# Altium schematic sheet main.SchDoc
size A; SheetNumber: 1; SheetTotal: 1
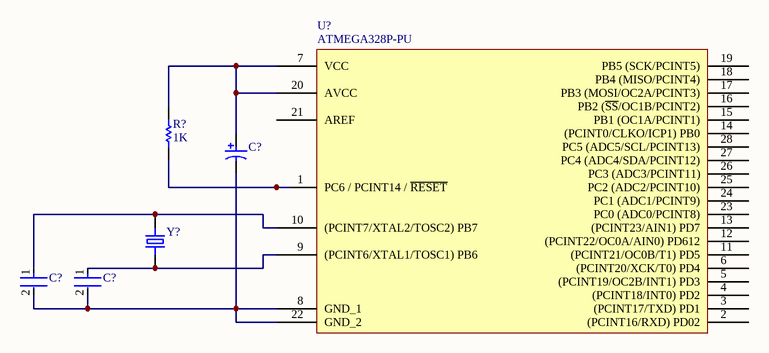
[diagram p0: main.SchDoc]

## Parts
(Parts that share a designator on the sheet are numbered #1, #2 ... from top to bottom, then left to right.)
C?#1  EEE-1CA100SR  [PNSC-EEE1CA100SR_L]  (value not drawn)
C?#2  02013A220JAT2A  [FP-0201-L_0_6_0_09-W_0_3-MFG]  (value not drawn)
C?#3  02013A220JAT2A  [FP-0201-L_0_6_0_09-W_0_3-MFG]  (value not drawn)
R?  1K  [RESA60-630X240]
U?  ATMEGA328P-PU  [27_DIP_7.62mm]
Y?  ECS-160-S-1X  [XTAL_ECS-160-S-1X]  (value not drawn)

## Nets
NetC?#1_1: C?#1.1 R?.1 U?.7(VCC) U?.20(AVCC)
NetC?#1_2: C?#1.2 C?#2.2 C?#3.2 U?.8(GND_1) U?.22(GND_2)
NetC?#2_1: C?#2.1 U?.10((PCINT7/XTAL2/TOSC2)_PB7) Y?.2
NetC?#3_1: C?#3.1 U?.9((PCINT6/XTAL1/TOSC1)_PB6) Y?.1
NetR?_2: R?.2 U?.1(PC6_/_PCINT14_/_~{RESET})

Not connected (* = marked no-connect by the designer): U? 2((PCINT16/RXD)_PD02) 3((PCINT17/TXD)_PD1) 4((PCINT18/INT0)_PD2) 5((PCINT19/OC2B/INT1)_PD3) 6((PCINT20/XCK/T0)_PD4) 11((PCINT21/OC0B/T1)_PD5) 12((PCINT22/OC0A/AIN0)_PD612) 13((PCINT23/AIN1)_PD7) 14((PCINT0/CLKO/ICP1)_PB0) 15(PB1_(OC1A/PCINT1)) 16(PB2_(~{SS}/OC1B/PCINT2)) 17(PB3_(MOSI/OC2A/PCINT3)) 18(PB4_(MISO/PCINT4)) 19(PB5_(SCK/PCINT5)) 21(AREF) 23(PC0_(ADC0/PCINT8)) 24(PC1_(ADC1/PCINT9)) 25(PC2_(ADC2/PCINT10)) 26(PC3_(ADC3/PCINT11)) 27(PC4_(ADC4/SDA/PCINT12)) 28(PC5_(ADC5/SCL/PCINT13))

## Library data of the parts
C?#1 = CMP-2000-06199-1: Aluminum Electrolytic Capacitor, 10 uF, +/- 20%, -40 to 85 degC, 2-Pin SMD, RoHS, Tape and Reel; Manufacturer: Panasonic; Lead Length: 1.8mm; No. of Pins: 2; Ripple Current Frequency: 120Hz; Ripple Current Temperature: 85°C; External Depth: 4.3mm; Operating Lifetime: 2000h; Power Factor: 0.16; Lead Cross-section Width: 0.65mm; Product Range: PANASONIC-SSeries; Voltage Rating V DC: 16V; Leakage Current: 3µA; Ripple Current AC: 28mA; AE Capacitor Case: RadialCan-SMD; Capacitance: 10µF; Lifetime @ Temperature: 2000hours@85°C; External Length / Height: 5.4mm; SVHC: NoSVHC(16-Dec-2013); Packaging: CutTape; Series: VS; Package Description: 2-Pin Surface Mount Device, Body 4.5 x 4.5 mm; Tolerance -: 20%; Capacitor Terminals: SMD; Lead Spacing: 1mm; Package / Case: B; Capacitance Tolerance: ±20%; Operating life Time: 2000h; Tape Width: 12mm; Power Factor Frequency: 120Hz; Voltage Rating: 16V; Diameter: 4mm; Operating Temperature Max: 85°C; Datasheet URL: https://datasheet.ciiva.com/19458/1355487-19458346.pdf; Capacitor Mounting: SMD; External Width: 4.3mm; Operating Life Temperature: 85°C; Capacitance Tolerance ±: ±20%; Package Reference: EEE1CA100SR; AC Ripple Current: 28mA; Tolerance +: 20%; Height: 5.4mm; Datasheet Version: 04/2005; Operating Temperature Min: -40°C; Capacitor Case Style: RadialCan-SMD; Mounting Technology: SurfaceMount; Operating Temperature Range: -40°Cto+85°C; Manufacturer URL: http://www.panasonic.com/; Life Time @ Temperature: 2000hours@85°C
C?#2 C?#3 = CMP-2010-00022-2: General Purpose Ceramic Capacitor, 0201, 22pF, 5%, C0G, 30ppm/°C, 25V; Depth: 0.3mm; Termination: SMD/SMT; Voltage: 25V; Packaging: Tape and Reel; Radiation Hardening: No; Package Quantity: 1; Case/Package: 0201; Case Code (Metric): 0603; Thickness: 0.013inch; Tolerance: 5%; Voltage Rating (DC): 25V; Voltage Rating: 25V; Number of Pins: 2; Dielectric: C0G; Height: 0.33mm; Capacitance: 22pF; Min Operating Temperature: -55°C; RoHS Compliant: Yes; Lead Free: Lead Free; Length: 0.6mm; Series: -; REACH SVHC: No SVHC; Width: 0.3mm; Construction: Flat; Case Code (Imperial): 0201; Mount: Surface Mount; Max Operating Temperature: 125°C; Temperature Coefficient: 30ppm/°C
R? = CMP-1659-00074-2: Axial Resistor, 10 KOhm, +/- 1%, 0.25 W, -55 to 155 degC, 2-Pin THD, RoHS, Bulk; Manufacturer: Yageo; Temperature Coefficient: 100ppm\/degreesC; Voltage Rating: 250V; Voltage Rating (DC): 200V; Resistance: 1KOhm; Max Power Dissipation: 250mW; Datasheet URL: http://www.yageo.com/documents/recent/Yageo%20LR_MFR_2013.pdf; Packaging: Bulk; RoHSCompliant: True; Mount: ThroughHole; Package Reference: MFR-25; Termination: Axial; Composition: MetalFilm; Number of Terminations: 2; Package Quantity: 200; Mounting Technology: ThroughHole; Length: 0.248inch; Max Operating Temperature: 155degC; Min Operating Temperature: -55degC; Datasheet Version: 04/2013; Lead Free: LeadFree; Manufacturer URL: http://www.yageo.com/; Tolerance: 1%; Power Rating: 250mW; Package Description: 2-Pin Axial Lead, Dia 2.4 mm, Body Length 6.3 mm; Military Standard: Not; Case\/Package: Axial
U? = ATMEGA328P-PU: ATMEGA328P-PU; 8 bit Microcontroller AVR 20MHz 1; 32kb Flash; 2kb RAM; I2C SPI 2; Manufacturer: Microchip / Atmel; Number of PWM Channels: 6; Number of Timers/Counters: 3; Min Supply Voltage: 1.8V; Max Supply Voltage: 5.5V; Interface: I2C,SPI,UART,USART,2-Wire; Number of I/Os: 23; Oscillator Type: Internal; Data Bus Width: 8b; Number of SPI Channels: 1; Watchdog Timer: Yes; Peripherals: Brown-out Detect/Reset,POR,PWM,WDT; Manufacturer Part Number: ATMEGA328P-PU; RoHS: Yes; Category: Microcontrollers; Stock 1: 5280; Pricing 1: 1=2,08000, 25=1,91000, 100=1,73000 (USD); Mount: Through Hole; Case/Package: PDIP; Number of Pins: 28; Contact Plating: Tin,Matte; Min Operating Temperature: -40°C; Max Operating Temperature: 85°C; Package Quantity: 14; Core Architecture: AVR; RAM Size: 2KB; Number of ADC Channels: 6; Packaging: Rail/Tube; Frequency: 20MHz; Number of Programmable I/O: 23; Max Frequency: 20MHz; Number of I2C Channels: 1; Memory Type: FLASH; Memory Size: 32KB; Length: 37.4mm; Height: 3.28mm; Width: 6.76mm; Radiation Hardening: No; REACH SVHC: No SVHC; Lead Free: Lead Free; ComponentLink1URL: https://datasheet.ciiva.com/20168/73-4283-20168380.pdf?src-supplier=Rapid+Electronics; ComponentLink1Description: https://datasheet.ciiva.com/20168/73-4283-20168380.pdf?src-supplier=Rapid+Electronics; ComponentLink2URL: https://datasheet.ciiva.com/19457/2139111-19457070.pdf?src-supplier=Jameco; ComponentLink2Description: https://datasheet.ciiva.com/19457/2139111-19457070.pdf?src-supplier=Jameco; ComponentLink3URL: https://datasheet.ciiva.com/1157/1684409-1157696.pdf?src-supplier=Element14; ComponentLink3Description: https://datasheet.ciiva.com/1157/1684409-1157696.pdf?src-supplier=Element14; ComponentLink4URL: https://datasheet.ciiva.com/26818/atmega328p-pu-26818578.pdf?src-supplier=IIIC; ComponentLink4Description: https://datasheet.ciiva.com/26818/atmega328p-pu-26818578.pdf?src-supplier=IIIC; ComponentLink5URL: https://datasheet.ciiva.com/29119/155197-da-01-en-microcontr-atmega328p-pu-8bit-pdip-28-29119593.pdf?src-supplier=Conrad; ComponentLink5Description: https://datasheet.ciiva.com/29119/155197-da-01-en-microcontr-atmega328p-pu-8bit-pdip-28-29119593.pdf?src-supplier=Conrad; ComponentLink6URL: https://datasheet.ciiva.com/15213/getdatasheetpartid-318533-15213133.pdf?src-supplier=Verical; ComponentLink6Description: https://datasheet.ciiva.com/15213/getdatasheetpartid-318533-15213133.pdf?src-supplier=Verical; Supplier 1: Digi-Key; Supplier Part Number 1: ATMEGA328P-PU-ND
Y? = ECS-160-S-1X: 16MHz Â±30ppm Crystal Series 20 Ohms HC-49/U; MF: ECS Inc.; Value: *; MP: ECS-160-S-1X; SnapEDA_Link: https://www.snapeda.com/parts/ECS-160-S-1X/ECS%20Inc./view-part/2458894/?ref=snap; Availability: Unavailable; Package: HC49/U ECS International; Price: None